# EAGLE design remote_rev_a (EAGLE 7.3.0)
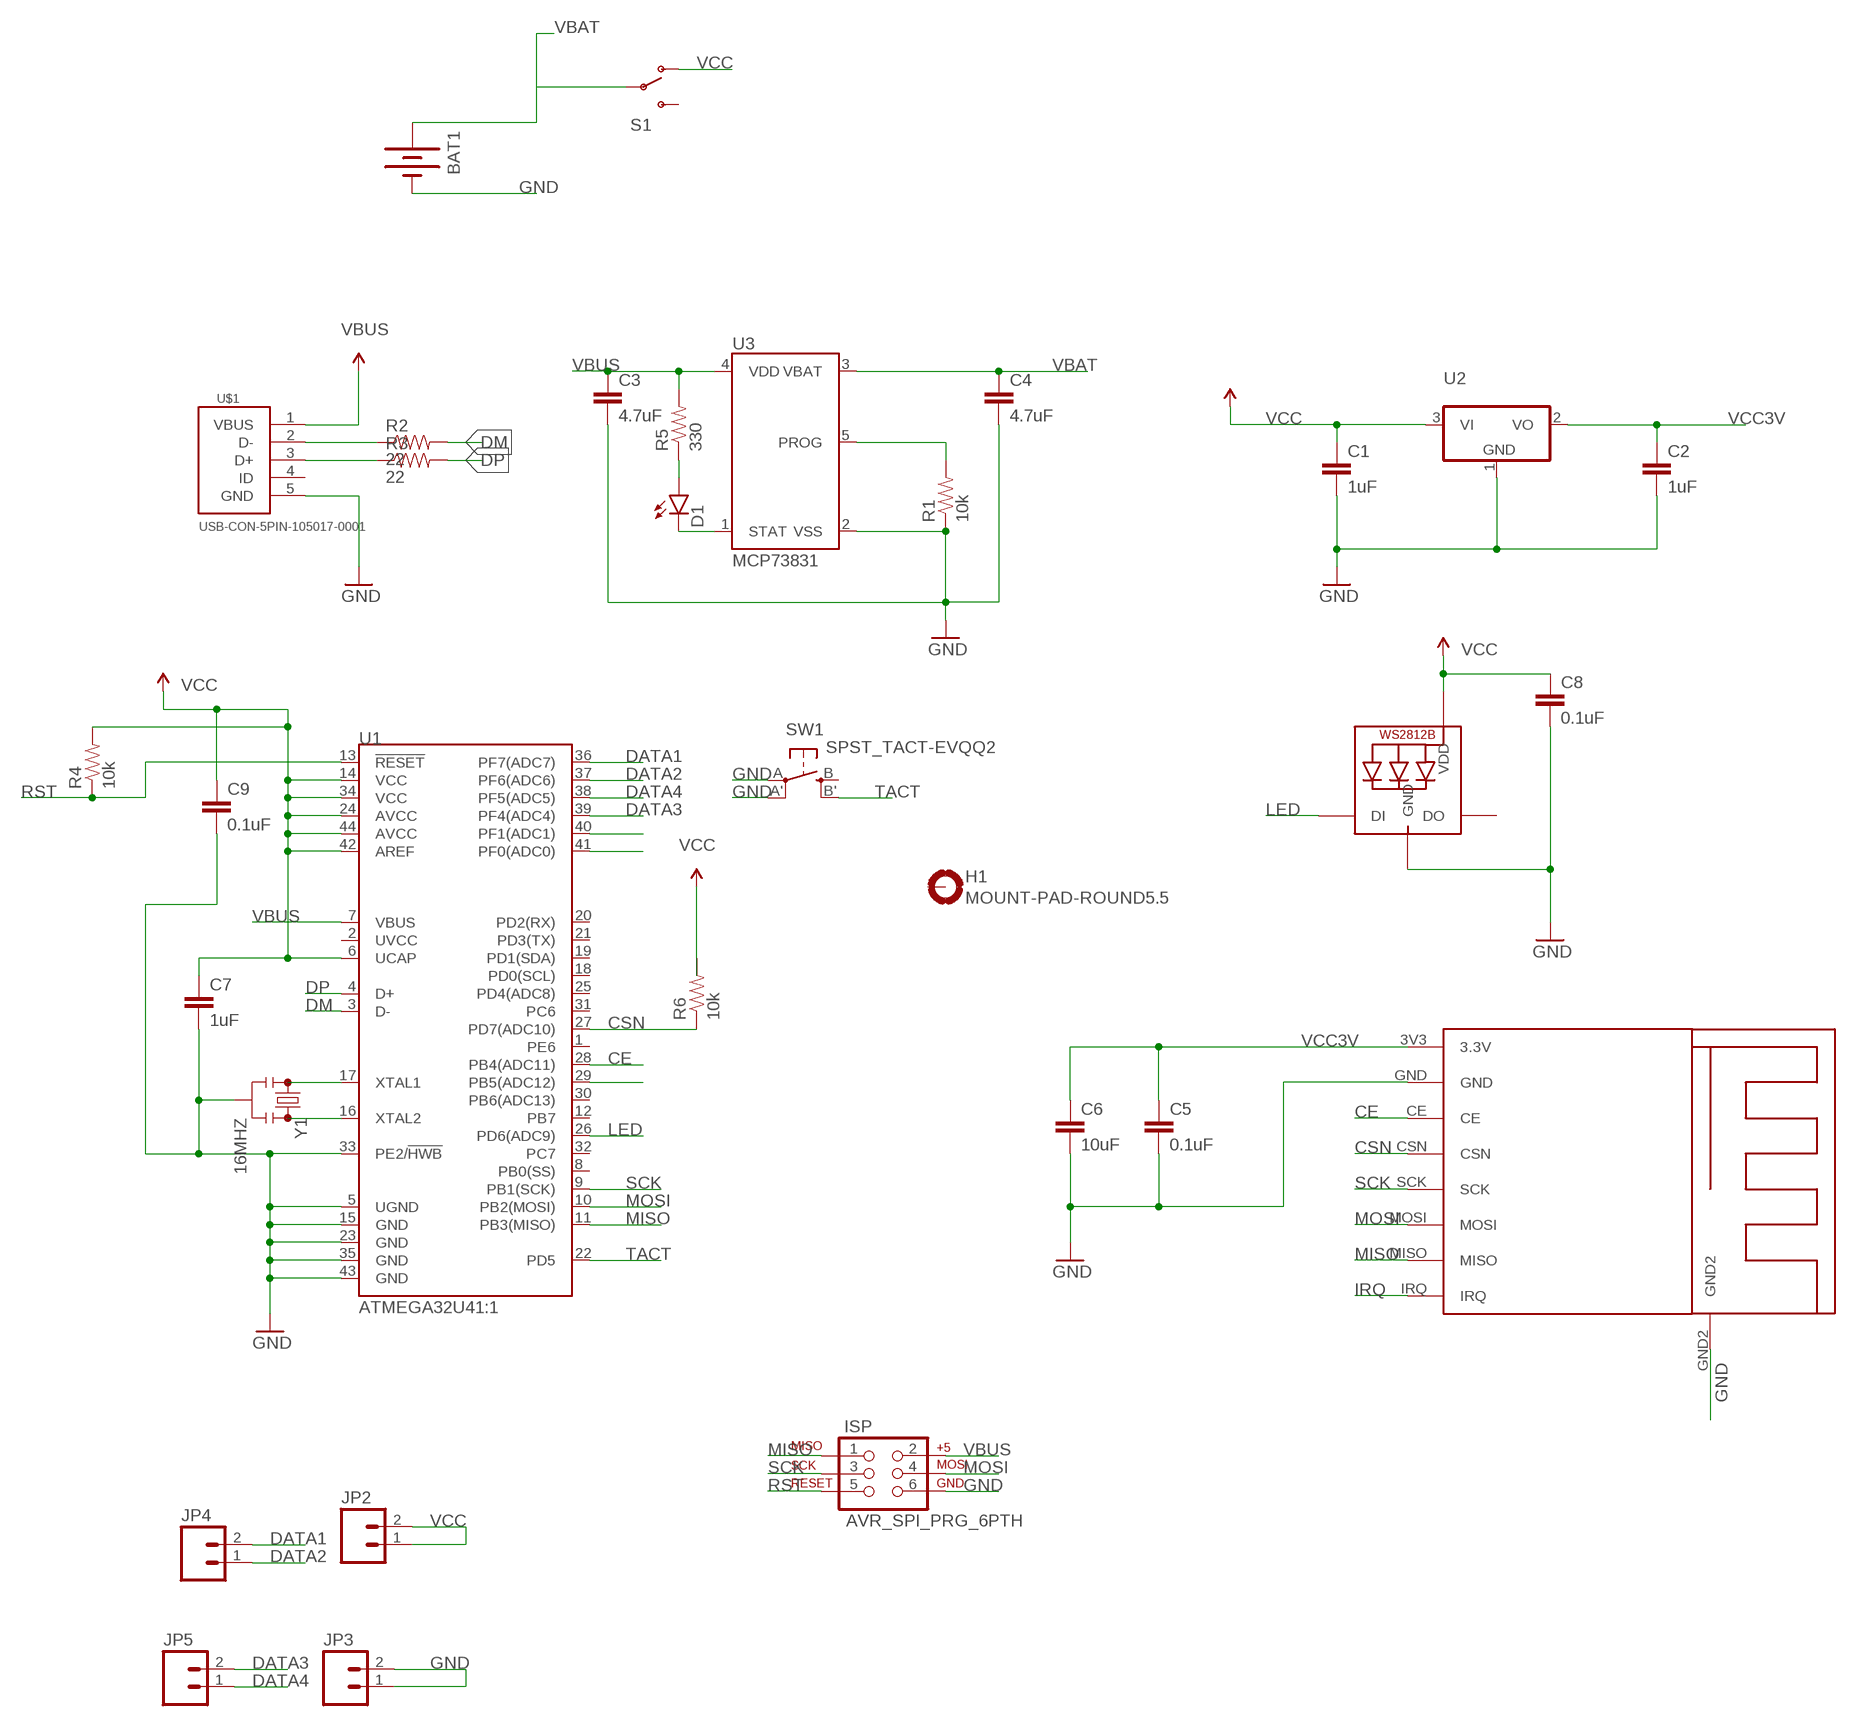
[diagram p0: schematic, sheet 1]

## Parts
BAT1  BATTERY245PTH  [BATTCON_245MM_PTH]
C1  1uF  CAP0603-CAP  [0603-CAP]
C2  1uF  CAP0603-CAP  [0603-CAP]
C3  4.7uF  CAP0603-CAP  [0603-CAP]
C4  4.7uF  CAP0603-CAP  [0603-CAP]
C5  0.1uF  CAP0603-CAP  [0603-CAP]
C6  10uF  CAP0603-CAP  [0603-CAP]
C7  1uF  CAP0603-CAP  [0603-CAP]
C8  0.1uF  CAP0603-CAP  [0603-CAP]
C9  0.1uF  CAP0603-CAP  [0603-CAP]
D1  LED0603  [LED-0603]
H1  MOUNT-PAD-ROUND5.5  [5,5-PAD]
ISP  AVR_SPI_PRG_6PTH  [2X3]
JP2  M02PTH  [1X02]
JP3  M02PTH  [1X02]
JP4  M02PTH  [1X02]
JP5  M02PTH  [1X02]
LED1  WS2812B_5050N  [WS2812B-NARROW]
R1  10k  RESISTOR0603-RES  [0603-RES]
R2  22  RESISTOR0603-RES  [0603-RES]
R3  22  RESISTOR0603-RES  [0603-RES]
R4  10k  RESISTOR0603-RES  [0603-RES]
R5  330  RESISTOR0603-RES  [0603-RES]
R6  10k  RESISTOR0603-RES  [0603-RES]
S1  SWITCH-SPDTPTH  [SWITCH-SPDT]
SW1  SPST_TACT-EVQQ2  [EVQ-Q2]
U1  ATMEGA32U41:1  [QFN-44-NOPAD_1:1]
U2  AP2120N-3.0  [SOT-23-3]
U3  MCP73831  [SOT23-5]
U$1  USB-CON-5PIN-105017-0001  [USB-MICRO-MOLEX-105017-0001]
U$3  NRF24MINI  [NRF24MINI]
Y1  16MHZ  RESONATOR16MHZ  [RESONATOR-SMD]

## Nets
CE: U1.28(PB4(ADC11)) U$3.CE
CSN: R6.1 U1.27(PD7(ADC10)) U$3.CSN
DATA1: JP4.2 U1.36(PF7(ADC7))
DATA2: JP4.1 U1.37(PF6(ADC6))
DATA3: JP5.2 U1.39(PF4(ADC4))
DATA4: JP5.1 U1.38(PF5(ADC5))
DM: R2.2 U1.3(D-)
DP: R3.2 U1.4(D+)
GND: BAT1.2(-) C1.2 C2.2 C3.2 C4.2 C5.2 C6.2 C7.2 C8.2 C9.2 ISP.6 JP3.1 JP3.2 LED1.3-GND(GND) R1.1 SW1.A'(P1) SW1.A(P) U1.5(UGND) U1.15(GND) U1.23(GND) U1.33(PE2/!HWB) U1.35(GND) U1.43(GND) U2.1(GND) U3.2(VSS) U$1.5(GND) U$3.GND U$3.GND2 Y1.2
IRQ: U$3.IRQ
LED: LED1.4-DIN(DI) U1.26(PD6(ADC9))
MISO: ISP.1 U1.11(PB3(MISO)) U$3.MISO
MOSI: ISP.4 U1.10(PB2(MOSI)) U$3.MOSI
N$1: R1.2 U3.5(PROG)
N$2: R2.1 U$1.2(D-)
N$3: R3.1 U$1.3(D+)
N$4: U1.17(XTAL1) Y1.1
N$5: U1.16(XTAL2) Y1.3
N$6: D1.A R5.1
N$7: D1.C U3.1(STAT)
N$9: U1.29(PB5(ADC12))
N$13: U1.40(PF1(ADC1))
N$14: U1.41(PF0(ADC0))
RST: ISP.5 R4.1 U1.13(!RESET)
SCK: ISP.3 U1.9(PB1(SCK)) U$3.SCK
TACT: SW1.B'(S1) U1.22(PD5)
VBAT: BAT1.1(+) BAT1.3(+) C4.1 S1.2(P) U3.3(VBAT)
VBUS: C3.1 ISP.2 R5.2 U1.7(VBUS) U3.4(VDD) U$1.1(VBUS) ; supply symbol labelled VCC
VCC: C1.1 C7.1 C8.1 C9.1 JP2.1 JP2.2 LED1.1-VDD(VDD) R4.2 S1.1(O) U1.6(UCAP) U1.14(VCC) U1.24(AVCC) U1.34(VCC) U1.42(AREF) U1.44(AVCC) U2.3(VI)
VCC3V: C2.1 C5.1 C6.1 U2.2(VO) U$3.3V3(3.3V)
Unconnected: H1.B5,5(MOUNT) LED1.2-DOUT(DO) R6.2 S1.3(S) SW1.B(S) U1.1(PE6) U1.2(UVCC) U1.8(PB0(SS)) U1.12(PB7) U1.18(PD0(SCL)) U1.19(PD1(SDA)) U1.20(PD2(RX)) U1.21(PD3(TX)) U1.25(PD4(ADC8)) U1.30(PB6(ADC13)) U1.31(PC6) U1.32(PC7) U$1.4(ID)

## Library data of the parts
BAT1 = SparkFun-Electromechanical:BATTERY: Battery Holders Various common sizes : AA, AAA, 18650 (PRT-12895), 20mm coin cell and 12mm coin cell. 20MM_4LEGS, BATT-10373
C1-C9 = SparkFun-Capacitors:CAP: Capacitor Standard 0603 ceramic capacitor, and 0.1" leaded capacitor.
D1 = SparkFun-LED:LED: LEDs Standard schematic elements and footprints for 5mm, 3mm, 1206, and 0603 sized LEDs. 5mm - Spark Fun Electronics SKU : COM-00529 (and others)
H1 = holes:MOUNT-PAD-ROUND: MOUNTING PAD, round
ISP = SparkFun-Connectors:AVR_SPI_PRG_6: AVR ISP 6 Pin This is the reduced ISP connector for AVR programming. Common on Arduino. This footprint will take up less PCB space and can be used with a 10-pin to 6-pin adapter such as SKU: BOB-08508 **Special note about "TEST_POINT" package. The stop mask is on the top side, so if you want your programming test points to be on the bottom of your board, make sure to place this package on the bottom side of the board. This also ensure that the orientation to program from the bottom side will be correct.
JP2-JP5 = SparkFun-Connectors:M02: Standard 2-pin 0.1" header. Use with - straight break away headers ( PRT-00116) - right angle break away headers (PRT-00553) - swiss pins (PRT-00743) - machine pins (PRT-00117) - female headers (PRT-00115) Molex polarized connector foot print use with: PRT-08233 with associated crimp pins and housings. 2.54_SCREWTERM for use with PRT-10571. 3.5mm Screw Terminal footprints for PRT-08084 5mm Screw Terminal footprints for use with PRT-08432
LED1 = adafruit:WS2812B
R1-R6 = SparkFun-Passives:RESISTOR: Resistor Basic schematic elements and footprints for 0603, 1206, and PTH resistors.
S1 = SparkFun-Electromechanical:SWITCH-SPDT: SPDT Switch Simple slide switch, Spark Fun Electronics SKU : COM-00102 DPDT SMT slide switch, AYZ0202, SWCH-08179; PROD_ID: SWCH-08261
SW1 = adafruit:SPST_TACT: SMT 6mm switch, EVQQ2 series http://www.ladyada.net/library/eagle
U1 = SparkFun-DigitalIC:ATMEGA32U4: Atmel 44-pin 8-bit Microcontroller with 32KBytes of ISP Flash and USB Controller
U2 = Custom:AP2120N-3.0
U3 = GeekAmmo:MCP73831: MCP73831 Miniature Single-Cell, Fully Integrated Li-Ion, Li-Polymer Charge Management Controllers The MCP73831/2 devices are highly advanced linear charge management controllers for use in spacelimited, cost-sensitive applications. http://ww1.microchip.com/downloads/en/DeviceDoc/20001984F.pdf
U$1 = GeekAmmo:USB-CON-5PIN: Molex Micro USB 105017-0001
U$3 = nrf24mini:NRF24MINI
Y1 = SparkFun-FreqCtrl:RESONATOR: Resonator Small SMD resonator. Used, eg, on the Arduino Pro/ Pro Mini boards. 8MHz- XTAL-08895 16MHz- XTAL-08900; PROD_ID: XTAL-08900

## Board
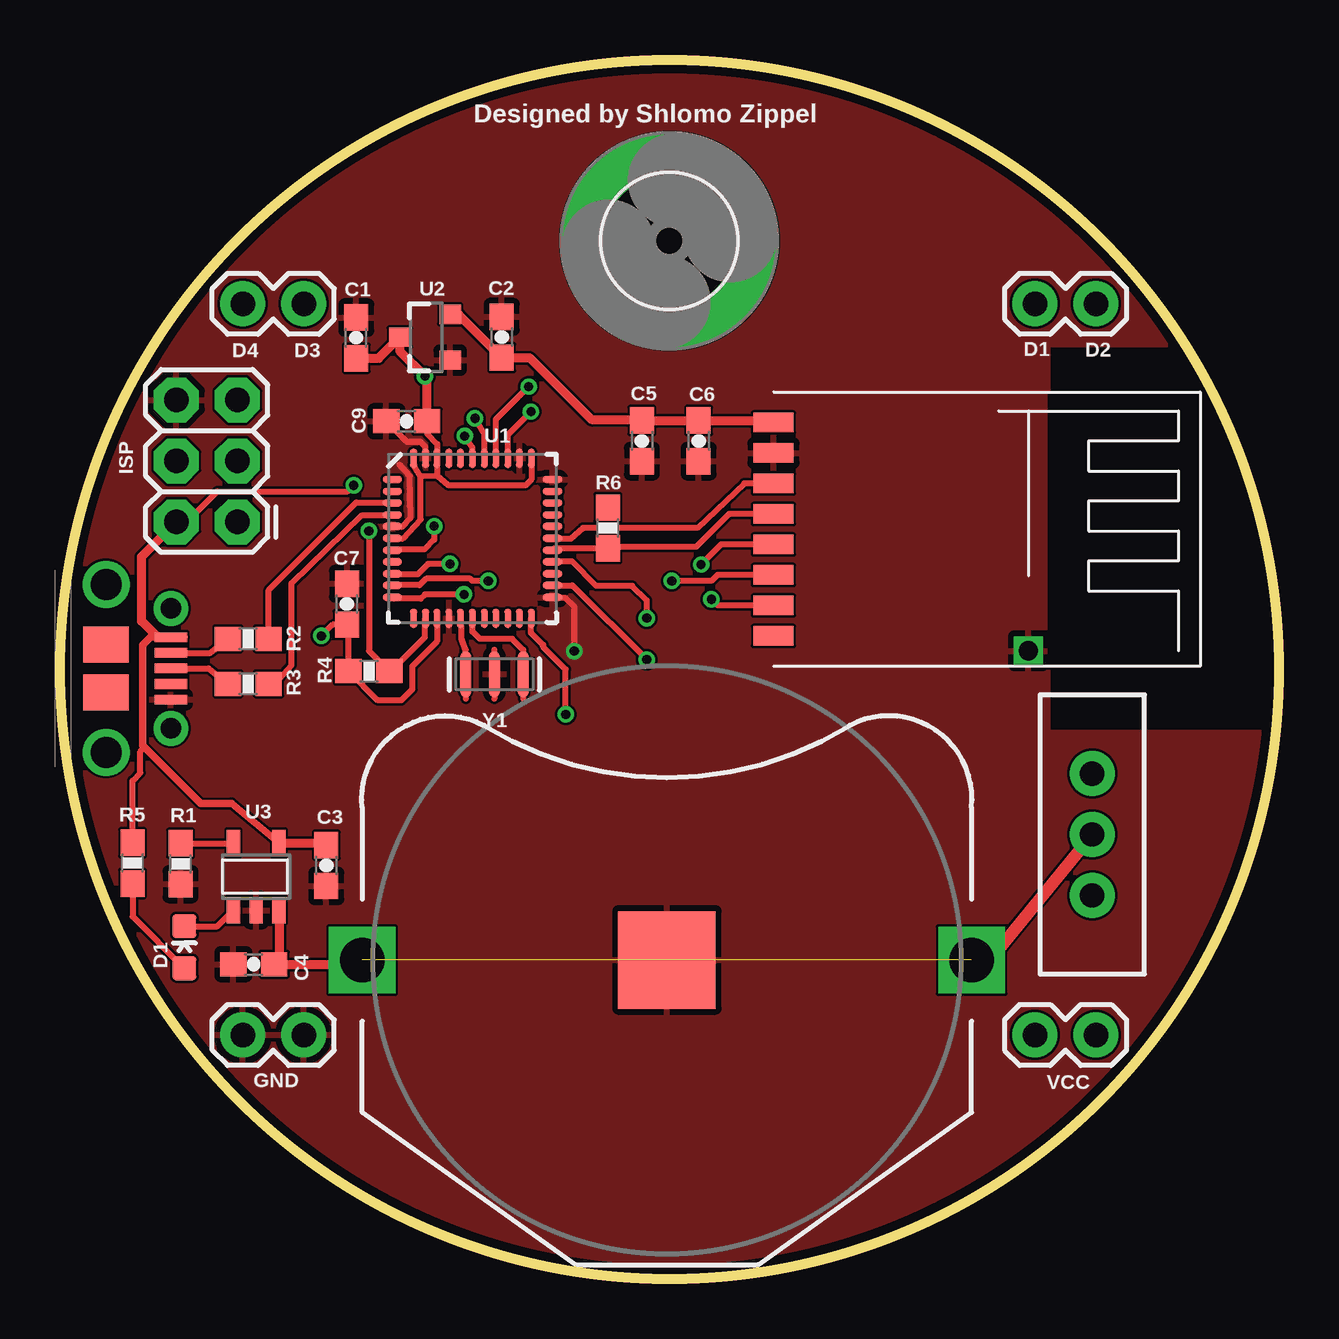
[diagram p1: board, top side]
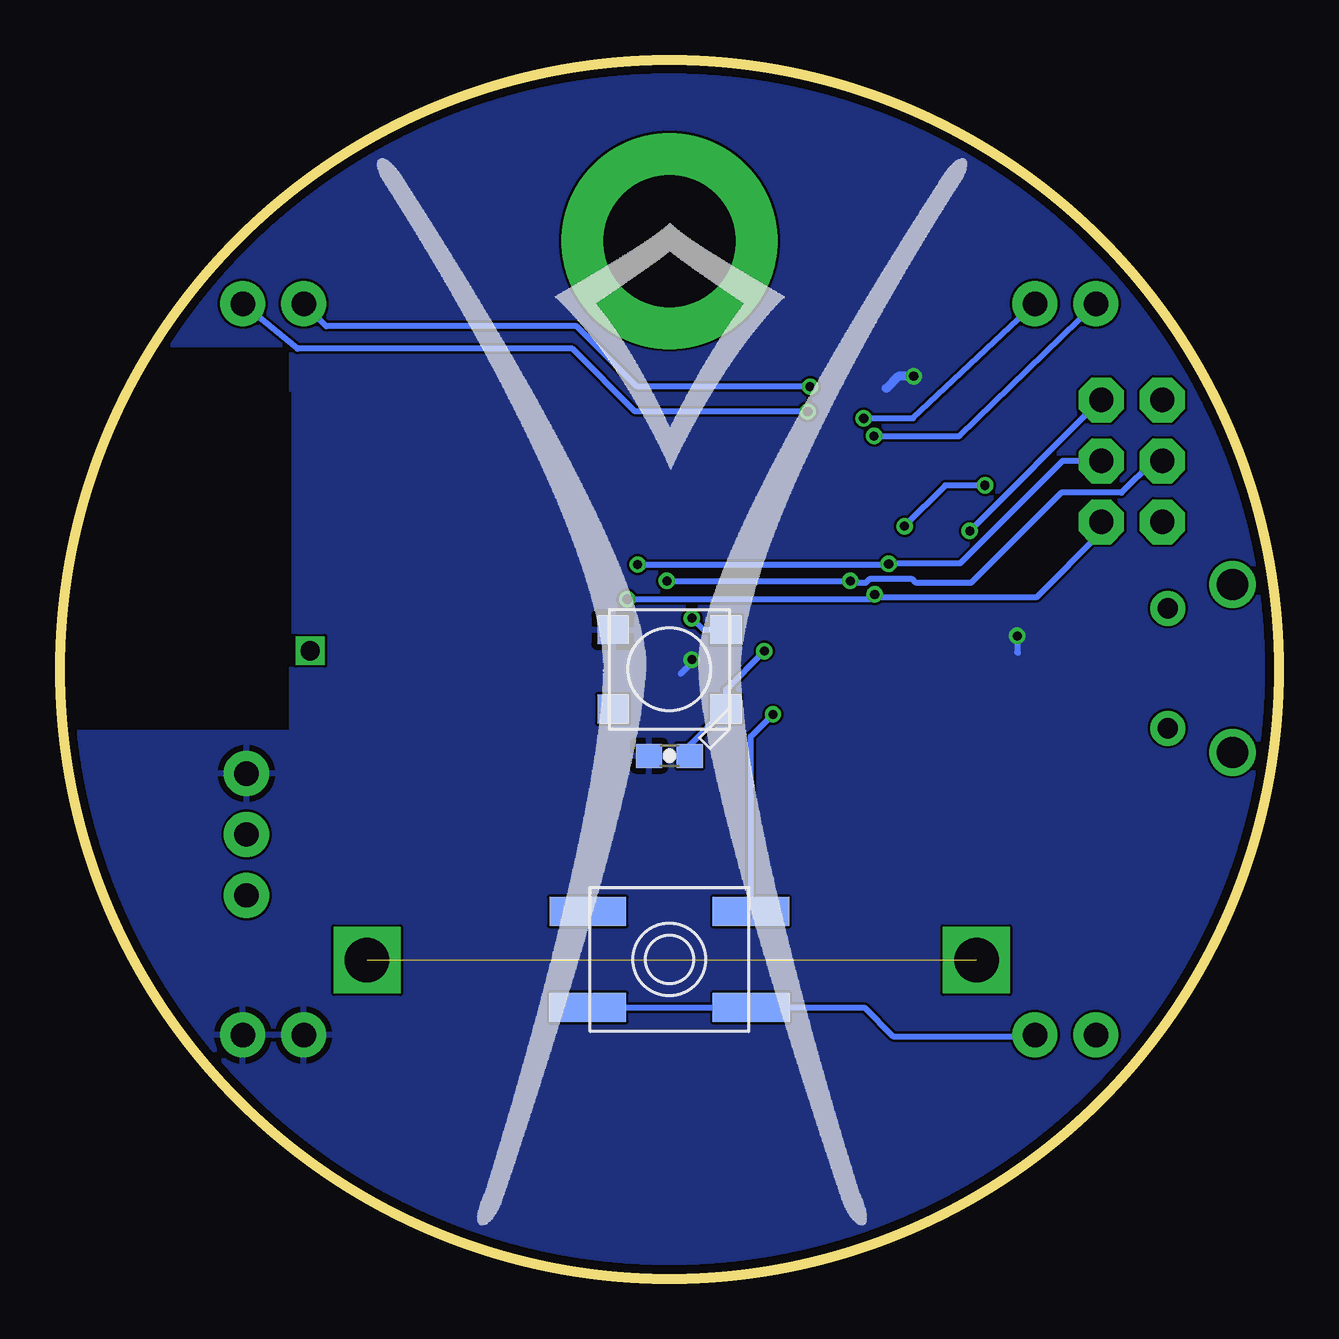
[diagram p2: board, bottom side, seen from below]

Size 50.8 x 50.8 mm. Coordinates in mm from the lower left corner, seen from the top.
Outline: circle at 25.4,25.4 radius 25.4
Copper layers (1*16): Top 0.0178mm / dielectric 59mil / Bottom 0.0178mm
Design rules "TA_eagle_rules_2_layer_v1": minimum track width 5mil, minimum drill 8mil, track to track 4mil, track to pad 5mil, pad to pad 5mil, via to via 5mil, smd to smd 5mil, copper to edge 15mil, drill to drill 15mil, minimum pad ring 6mil, minimum via ring 6mil, stop-mask expansion 3mil, vias tented up to drill 0mil, thermal gap 10mil
tRestrict: area 41.3,22.9 to 51.4,38.8
bRestrict: area 41.3,22.9 to 51.4,38.8

### Footprints (pad centres in the part's own frame; a part is rotated, then mirrored left to right if it is on the bottom)
BATTCON_245MM_PTH = drill 1.854 square: 1 -12.7,0; 3 12.7,0 | smd 4.064 x 4.064: 2 0,0
0603-CAP = smd 1.1 x 1: 1 -0.85,0; 2 0.85,0
LED-0603 = smd 1 x 1: A 0,-0.877; C 0,0.877
5,5-PAD = drill 5.5 pad 9: B5,5 0,0
2X3 = drill 1.016 pad 1.88 octagon: 1 0,0; 2 0,2.54; 3 2.54,0; 4 2.54,2.54; 5 5.08,0; 6 5.08,2.54
1X02 = drill 1.016 pad 1.88: 1 0,0; 2 2.54,0
WS2812B-NARROW = smd 1.3 x 1.2: 1-VDD 2.35,-1.65; 2-DOUT 2.35,1.65; 3-GND -2.35,1.65; 4-DIN -2.35,-1.65
0603-RES = smd 1.1 x 1: 1 -0.85,0; 2 0.85,0
SWITCH-SPDT = drill 1.016 pad 1.88: 1 0,2.54; 2 0,0; 3 0,-2.54
EVQ-Q2 = smd 3.2 x 1.2: A -3.4,-2; A' 3.4,-2; B -3.4,2; B' 3.4,2
QFN-44-NOPAD_1:1 = smd 0.8 x 0.3: 1 -3.337,2.458; 2 -3.337,1.958; 3 -3.337,1.479; 4 -3.337,0.979; 5 -3.337,0.5; 6 -3.337,0; 7 -3.337,-0.5; 8 -3.337,-0.979; 9 -3.337,-1.479; 10 -3.337,-1.958; 11 -3.337,-2.458; 23 3.337,-2.458; 24 3.337,-1.958; 25 3.337,-1.479; 26 3.337,-0.979; 27 3.337,-0.5; 28 3.337,0; 29 3.337,0.5; 30 3.337,0.979; 31 3.337,1.479; 32 3.337,1.958; 33 3.337,2.458 | smd 0.3 x 0.8: 12 -2.458,-3.337; 13 -1.958,-3.337; 14 -1.479,-3.337; 15 -0.979,-3.337; 16 -0.5,-3.337; 17 0,-3.337; 18 0.5,-3.337; 19 0.979,-3.337; 20 1.479,-3.337; 21 1.958,-3.337; 22 2.458,-3.337; 34 2.458,3.337; 35 1.958,3.337; 36 1.479,3.337; 37 0.979,3.337; 38 0.5,3.337; 39 0,3.337; 40 -0.5,3.337; 41 -0.979,3.337; 42 -1.479,3.337; 43 -1.958,3.337; 44 -2.458,3.337
SOT-23-3 = smd 0.8 x 0.9: 1 -0.95,-1; 2 0.95,-1; 3 0,1.1
SOT23-5 = smd 0.55 x 1.1: 1 -0.95,-1.3; 2 0,-1.3; 3 0.95,-1.3; 4 0.95,1.5; 5 -0.95,1.5
USB-MICRO-MOLEX-105017-0001 = smd 0.4 x 1.35: 1 1.2,0; 2 1.85,0; 3 2.5,0; 4 3.15,0; 5 3.8,0 | drill 0.85 pad 1.45: P$1 0,0; P$2 5,0 | smd 1.5 x 1.9: P$3 3.5,-2.7; P$4 1.5,-2.7 | drill 1.3: P$7 -1,-2.7; P$8 6,-2.7
NRF24MINI = smd 1.676 x 0.813: 3V3 0,8.89; CE 0,6.35; CSN 0,5.08; GND 0,7.62; IRQ 0,0; MISO 0,1.27; MOSI 0,2.54; SCK 0,3.81 | drill 0.8 square: GND2 10.625,-0.625
RESONATOR-SMD = smd 0.45 x 1.905: 1 -1.2,0; 2 0,0; 3 1.2,0

### Placement (x,y rotation side)
BAT1  25.3,13.28 0 top
C1  12.34,39.22 90 top
C2  18.41,39.24 90 top
C3  11.1,17.22 270 top
C4  8.08,13.11 180 top
C5  24.26,34.92 270 top
C6  26.62,34.92 270 top
C7  11.96,28.12 90 top
C8  25.4,21.79 0 bottom
C9  14.45,35.74 180 top
D1  5.18,13.82 0 top
H1  25.4,43.26 0 top
ISP  7.39,31.55 90 top
JP2  40.64,10.16 0 top
JP3  10.16,10.16 180 top
JP4  40.64,40.64 0 top
JP5  10.16,40.64 180 top
LED1  25.4,25.4 180 bottom
R1  5.03,17.3 90 top
R2  7.85,26.67 0 top
R3  7.85,24.79 0 top
R4  12.88,25.32 180 top
R5  3.02,17.32 90 top
R6  22.83,31.29 90 top
S1  43.03,18.52 0 top
SW1  25.4,13.31 0 bottom
U1  17.2,30.86 0 top
U2  15.27,39.24 90 top
U3  8.18,16.66 0 top
U$1  4.62,27.94 270 top
U$3  29.74,26.8 0 top
Y1  18.11,25.2 180 top

### Tracks (layer width: path | path; a pad name or v marks a point on that pad's centre or on a via)
CE
  Top 0.254: U$3.CE 28.52,33.15 26.57,31.29 21.79,31.29 21.28,30.84 20.56,30.84 U1.28
CSN
  Top 0.254: U$3.CSN 27.89,31.88 26.52,30.5 22.9,30.5 R6.1 20.61,30.44 U1.27
DATA1  (via drill 0.38)
  Top 0.254: U1.36 18.67,35.19 v19.63,36.14
  Bottom 0.254: v19.63,36.14 26.82,36.14 29.44,38.76 40.89,38.76 JP4.2
DATA2  (via drill 0.38)
  Top 0.254: U1.37 18.17,35.83 v19.53,37.19
  Bottom 0.254: v19.53,37.19 26.75,37.19 29.26,39.7 39.7,39.7 JP4.1
DATA3  (via drill 0.38)
  Top 0.254: U1.39 17.2,34.65 v16.87,35.13
  Bottom 0.254: v16.87,35.13 13.31,35.13 JP5.2
DATA4  (via drill 0.38)
  Top 0.254: U1.38 17.7,35.21 v17.3,35.86
  Bottom 0.254: v17.3,35.86 15.24,35.86 JP5.1
DM
  Top 0.254: U1.3 13.84,32.36 12.34,32.36 8.7,28.71 R2.2
DP
  Top 0.254: R3.2 8.98,24.8 9.65,25.58 9.65,28.98 12.6,31.83 13.85,31.83 U1.4
GND  (via drill 0.38)
  Top 0.254: v21.44,26.16 21.44,28.02 21.08,28.37 20.56,28.37 U1.23 | U1.43 15.24,34.67 15.04,34.87 14.47,34.87 C9.2 | U1.5 14.24,31.34 14.6,31.72 14.58,33.45 14.15,33.93
  Bottom 0.254: C8.2 24.55,22.25 LED1.3-GND 23.05,24.55 v21.44,26.16 | JP3.1 10.21,10.11 16.08,10.11 17.28,11.31 SW1.A' 22.13,11.18 22.55,11.18 22.69,11.31 SW1.A
  pour Top: -0.25,52.93 53.97,52.93 53.97,-1.7 -0.43,-1.7 -0.43,52.88
LED  (via drill 0.38)
  Top 0.254: v24.46,27.53 24.46,28.27 23.85,28.88 22.35,28.88 21.34,29.9 20.55,29.9 U1.26
  Bottom 0.254: LED1.4-DIN 23.98,27.05 v24.46,27.53
MISO  (via drill 0.38)
  Top 0.254: U$3.MISO 27.41,28.07 v27.15,28.32 | v16.84,28.52 15.21,28.52 15.04,28.35 13.92,28.35 U1.11
  Bottom 0.254: v27.15,28.32 17.04,28.32 v16.84,28.52 16.71,28.4 10.11,28.4 7.39,31.11 ISP.1
MOSI  (via drill 0.38)
  Top 0.254: U$3.MOSI 27.41,29.34 27.15,29.08 v25.5,29.08 | v17.86,29.08 17.2,29.08 17.09,29.18 15.26,29.18 15.16,29.08 14.99,28.9 U1.10
  Bottom 0.254: v25.5,29.08 v17.86,29.08 17.78,29.01 17.22,29.01 17.07,29.16 15.26,29.16 15.11,29.01 12.83,29.01 9.07,32.77 6.55,32.77 5.23,34.09 ISP.4
N$1
  Top 0.254: R1.2 7.21,18.15 U3.5
N$2
  Top 0.254: U$1.2 6.27,26.09 R2.1
N$3
  Top 0.254: U$1.3 6.2,25.44 R3.1
N$4
  Top 0.254: 19.31,26.21 18.85,26.67 17.5,26.67 17.2,26.97 U1.17
N$5
  Top 0.254: 16.91,26.21 16.73,26.68 16.74,26.97 16.71,27.51 U1.16
N$6
  Top 0.254: R5.1 3.02,15.1 D1.A
N$7
  Top 0.254: D1.C 6.56,14.69 U3.1
RST  (via drill 0.38)
  Top 0.254: U1.13 15.21,27.5 15.21,26.75 13.79,25.32 R4.1 12.88,26.17 v12.88,31.17
  Bottom 0.254: ISP.5 7.44,36.63 v12.88,31.17
SCK  (via drill 0.38)
  Top 0.254: U$3.SCK 27.56,30.61 v26.72,29.77 | v16.26,29.79 15.34,29.79 14.91,29.36 13.88,29.36 U1.9
  Bottom 0.254: v26.72,29.77 16.28,29.77 v16.26,29.79 16.23,29.82 13.28,29.82 9.02,34.09 ISP.3
TACT  (via drill 0.38)
  Top 0.254: v21.08,23.52 21.08,25.4 20.14,26.34 20.14,26.42 19.63,26.92 19.63,27.5 U1.22
  Bottom 0.254: SW1.B' 22,22.6 v21.08,23.52
VBAT  (1 unrouted)
  Top 0.381: BAT1.1 12.42,13.11 C4.1 9.13,13.31 U3.3
  Top 0.508: BAT1.3 38.76,13.28 S1.2
VBUS  (via drill 0.38)
  Top 0.254: ISP.2 5.28,31.55 6.55,32.82 11.99,32.82 v12.24,33.07 | v15.6,31.37 15.6,30.81 15.19,30.4 13.9,30.4 U1.7 | R5.2 3.02,20.75 3.35,21.08 3.35,21.97 3.53,22.15
  Top 0.305: U3.4 7.15,19.81 5.87,19.81 3.53,22.15 3.45,22.22 3.45,26.42 3.78,26.74 U$1.1 5.17,26.74
  Top 0.381: U$1.1 4.07,26.74 3.4,27.41 3.4,30.1 ISP.2 | U3.4 11.01,18.16 C3.1
  Bottom 0.254: v12.24,33.07 13.89,33.07 v15.6,31.37
VCC  (via drill 0.38)
  Top 0.254: C9.1 15.3,35.22 15.72,34.8 U1.42 15.75,33.45 | v10.9,26.8 11.37,27.27 C7.1 12.03,27.2 R4.2 13.25,24.1 14.22,24.1 14.68,24.56 14.68,25.53 15.72,26.56 U1.14 | U1.34 19.65,33.32 19.41,33.07 16.2,33.07 15.75,33.45 | U1.24 21.36,28.9 v24.46,25.81 | U1.6 14.3,30.86 15.04,31.65 15.04,33.43 | 15.04,33.43 14.73,33.91 14.74,33.91 U1.44 | 15.75,33.45 15.04,33.43
  Top 0.381: C1.1 13.29,38.37 U2.3 14.16,38.67 v15.21,37.62 15.3,37.53 C9.1
  Bottom 0.254: v10.9,26.8 10.9,26.11 10.87,26.09 | v24.46,25.81 24.46,25.68 24.92,25.22
  Bottom 0.381: v15.21,37.62 15.85,37.62 16.36,37.11
  pour Bottom: 0.33,52.4 51.99,52.4 51.99,-0.97 -1.65,-0.97 -1.65,52.4
VCC3V
  Top 0.381: U2.2 16.61,40.19 C2.1 19.57,38.39 22.15,35.81 24.22,35.81 C5.1 C6.1 29.65,35.77 U$3.3V3

### Text on the board
tPlace: Designed by Shlomo Zippel | D4 | D3 | D1 | D2 | GND | VCC